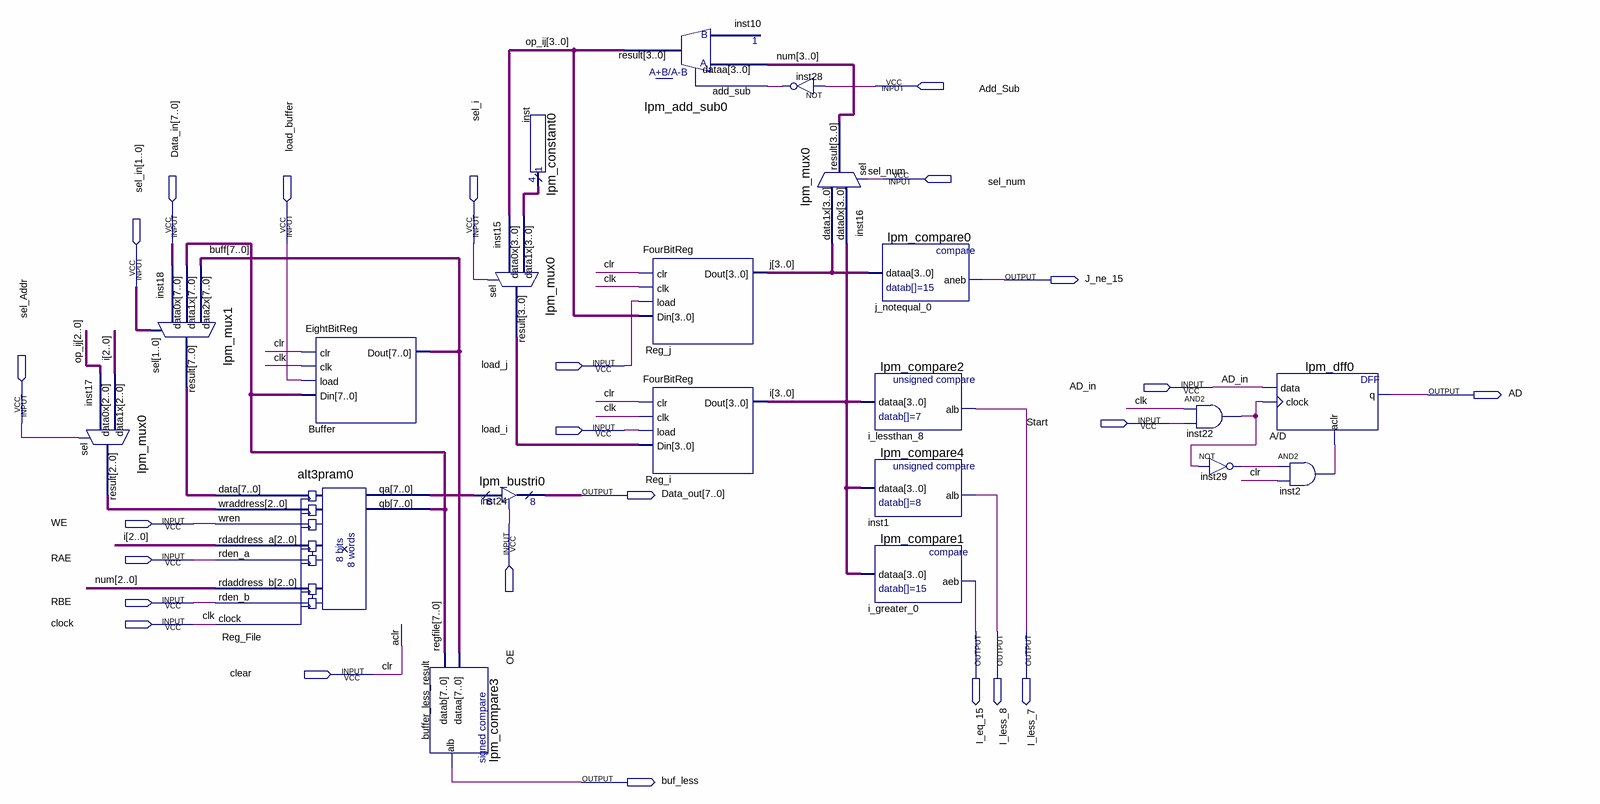
[diagram p0: schematic sheet]
// Quartus schematic sorting.bdf as structural Verilog: 21 symbols, 24 pins
module sorting (
  input  Add_Sub,
  input  sel_num,
  input  [7:0] Data_in,
  input  load_buffer,
  input  sel_i,
  input  [1:0] sel_in,
  input  load_j,
  input  AD_in,
  input  sel_Addr,
  input  Start,
  input  load_i,
  input  WE,
  input  OE,
  input  RAE,
  input  RBE,
  input  clock,
  input  clear,
  output J_ne_15,
  output AD,
  output [7:0] Data_out,
  output I_eq_15,
  output I_less_8,
  output I_less_7,
  output buf_less
);

  wire inst2_out, inst22_out, inst28_out, inst29_out;
  wire [2:0] inst17_result;
  wire [3:0] i, inst15_result, inst_result, j, num, op_ij;
  wire [7:0] buff, inst18_result, Reg_File_qa, regfile;

  lpm_mux0 inst17 (.data1x(i[2:0]), .data0x(op_ij[2:0]), .sel(sel_Addr), .result(inst17_result));
  lpm_mux1 inst18 (.data2x(buff), .data1x(regfile), .data0x(Data_in), .sel(sel_in), .result(inst18_result));
  alt3pram0 Reg_File (
    .data(inst18_result), .wraddress(inst17_result), .wren(WE), .rdaddress_a(i[2:0]), .rden_a(RAE),
    .rdaddress_b(num[2:0]), .rden_b(RBE), .clock(clock), .aclr(clear), .qa(Reg_File_qa), .qb(regfile));
  EightBitReg Buffer (.clr(clear), .clk(clock), .load(load_buffer), .Din(regfile), .Dout(buff));
  lpm_compare3 buffer_less_result (.dataa(buff), .datab(regfile), .alb(buf_less));
  lpm_mux0 inst15 (.data1x(inst_result), .data0x(op_ij), .sel(sel_i), .result(inst15_result));
  lpm_bustri0 inst24 (.enabledt(OE), .data(Reg_File_qa), .tridata(Data_out));
  lpm_constant0 inst (.result(inst_result));
  lpm_add_sub0 inst10 (.dataa(num), .add_sub(inst28_out), .result(op_ij));
  FourBitReg Reg_j (.clr(clear), .clk(clock), .load(load_j), .Din(op_ij), .Dout(j));
  FourBitReg Reg_i (.clr(clear), .clk(clock), .load(load_i), .Din(inst15_result), .Dout(i));
  not inst28 (inst28_out, Add_Sub);
  lpm_mux0 inst16 (.data1x(j), .data0x(i), .sel(sel_num), .result(num));
  lpm_compare0 j_notequal_0 (.dataa(j), .aneb(J_ne_15));
  lpm_compare2 i_lessthan_8 (.dataa(i), .alb(I_less_7));
  lpm_compare4 inst1 (.dataa(i), .alb(I_less_8));
  lpm_compare1 i_greater_0 (.dataa(i), .aeb(I_eq_15));
  and inst22 (inst22_out, clock, Start);
  not inst29 (inst29_out, inst22_out);
  lpm_dff0 \A/D  (.data(AD_in), .clock(inst22_out), .aclr(inst2_out), .q(AD));
  and inst2 (inst2_out, inst29_out, clear);

  // Other names for the same wires on the sheet: clk = clock; clr = clear
endmodule
